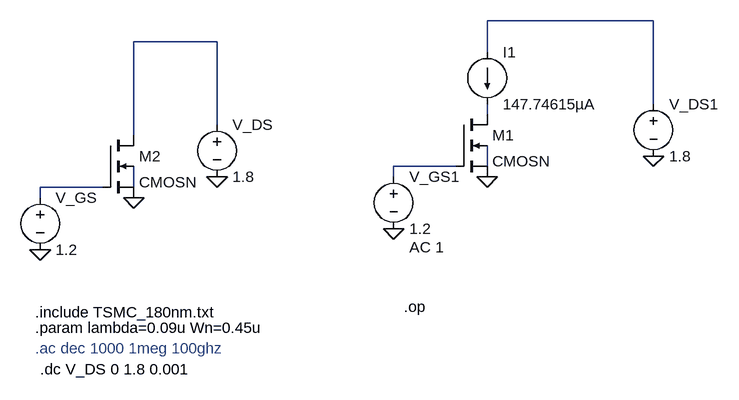
[diagram p0: schematic 3_TSMC.asc]
3_TSMC.asc, the LTspice schematic file:
Version 4
SHEET 1 2472 680
WIRE 1504 -160 1248 -160
WIRE 832 -128 704 -128
WIRE 1248 -112 1248 -160
WIRE 1504 -32 1504 -160
WIRE 1248 -16 1248 -32
WIRE 832 0 832 -128
WIRE 704 16 704 -128
WIRE 1200 64 1104 64
WIRE 1248 64 1248 32
WIRE 1104 80 1104 64
WIRE 656 96 560 96
WIRE 704 96 704 64
WIRE 560 112 560 96
FLAG 560 192 0
FLAG 704 112 0
FLAG 832 80 0
FLAG 1104 160 0
FLAG 1248 80 0
FLAG 1504 48 0
SYMBOL voltage 560 96 R0
WINDOW 123 0 0 Left 0
WINDOW 39 0 0 Left 0
SYMATTR InstName V_GS
SYMATTR Value 1.2
SYMBOL voltage 832 -16 R0
WINDOW 123 0 0 Left 0
WINDOW 39 0 0 Left 0
SYMATTR InstName V_DS
SYMATTR Value 1.8
SYMBOL nmos4 656 16 R0
SYMATTR InstName M2
SYMATTR Value CMOSN
SYMATTR Value2 l={2*lambda} w={Wn} ad={5*lambda*Wn} as={5*lambda*Wn} pd={2*Wn + 10*lambda} ps={2*Wn + 10*lambda}
SYMBOL voltage 1104 64 R0
WINDOW 123 24 124 Left 2
WINDOW 39 0 0 Left 0
SYMATTR Value2 AC 1
SYMATTR InstName V_GS1
SYMATTR Value 1.2
SYMBOL voltage 1504 -48 R0
WINDOW 123 0 0 Left 0
WINDOW 39 0 0 Left 0
SYMATTR InstName V_DS1
SYMATTR Value 1.8
SYMBOL nmos4 1200 -16 R0
SYMATTR InstName M1
SYMATTR Value CMOSN
SYMATTR Value2 l={2*lambda} w={Wn} ad={5*lambda*Wn} as={5*lambda*Wn} pd={2*Wn + 10*lambda} ps={2*Wn + 10*lambda}
SYMBOL current 1248 -112 R0
WINDOW 123 0 0 Left 0
WINDOW 39 0 0 Left 0
SYMATTR InstName I1
SYMATTR Value 147.74615µA
TEXT 552 312 Left 2 !.param lambda=0.09u Wn=0.45u
TEXT 552 344 Left 2 ;.ac dec 1000 1meg 100ghz
TEXT 560 376 Left 2 !.dc V_DS 0 1.8 0.001
TEXT 1120 280 Left 2 !.op
TEXT 552 288 Left 2 !.include TSMC_180nm.txt

The netlist it stands for:
* 3_TSMC.asc
V_GS N006 0 1.2
V_DS N002 0 1.8
M2 N002 N006 0 N007 CMOSN l={2*lambda} w={Wn} ad={5*lambda*Wn} as={5*lambda*Wn} pd={2*Wn + 10*lambda} ps={2*Wn + 10*lambda}
V_GS1 N004 0 1.2 AC 1
V_DS1 N001 0 1.8
M1 N003 N004 0 N005 CMOSN l={2*lambda} w={Wn} ad={5*lambda*Wn} as={5*lambda*Wn} pd={2*Wn + 10*lambda} ps={2*Wn + 10*lambda}
I1 N001 N003 147.74615µA
.model NMOS NMOS
.model PMOS PMOS
.lib standard.mos
.param lambda=0.09u Wn=0.45u
* .ac dec 1000 1meg 100ghz
.dc V_DS 0 1.8 0.001
.op
.include TSMC_180nm.txt
.backanno
.end